# Altium project caravan_pcb.PrjPcb
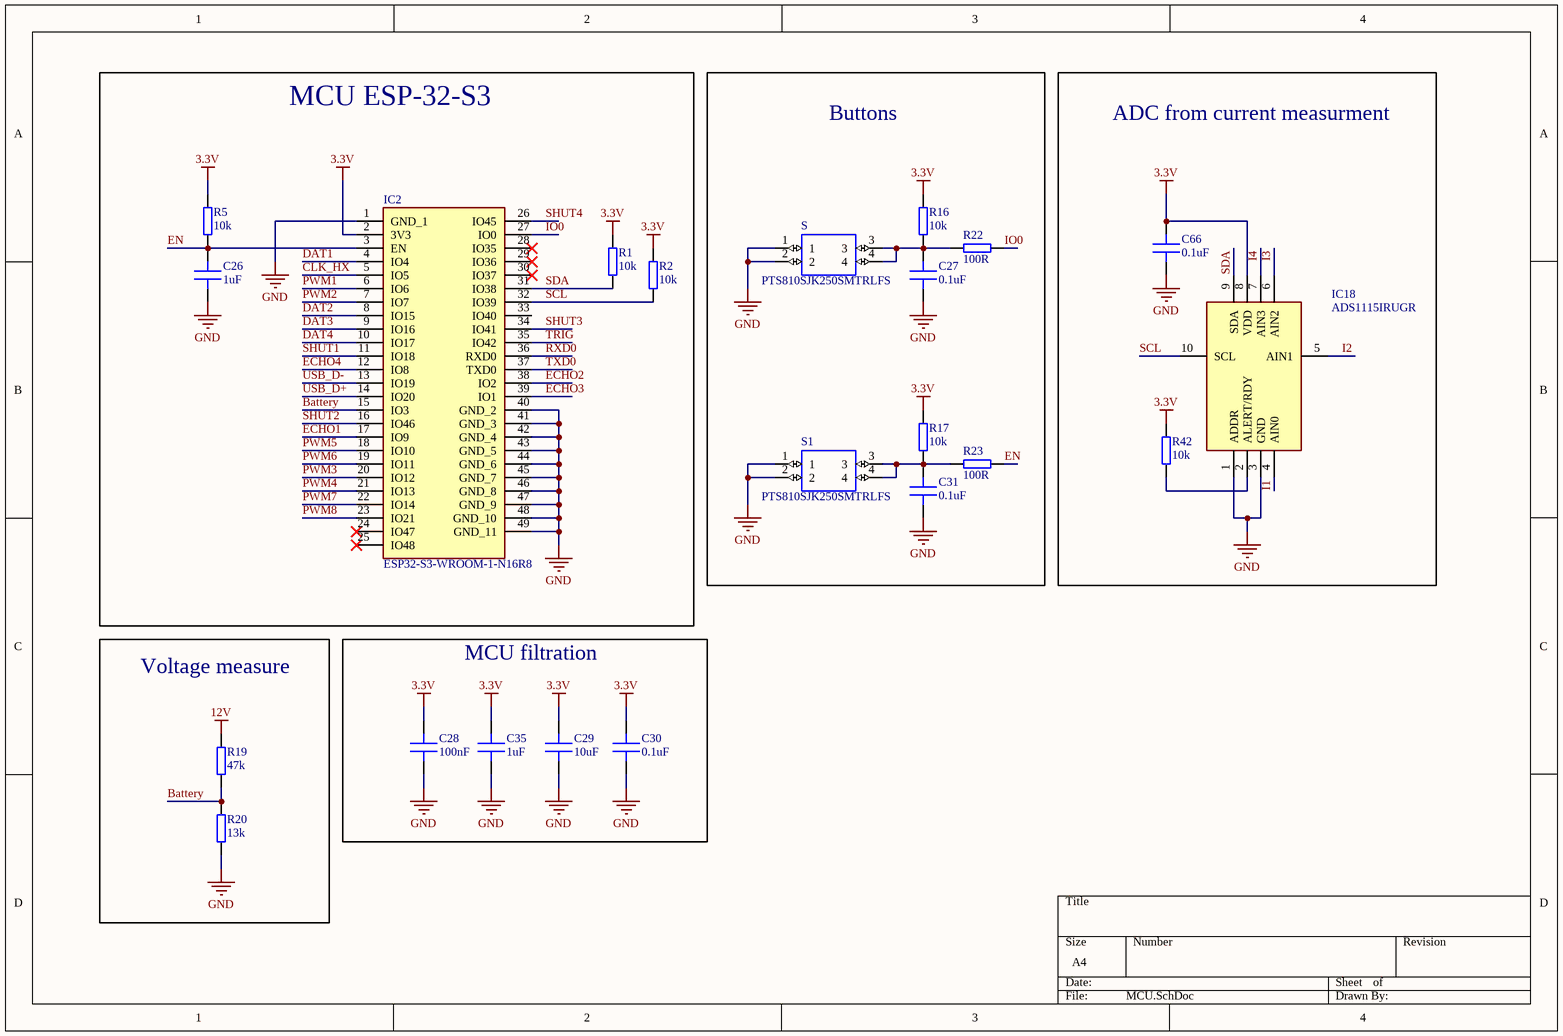
[diagram p0: MCU.SchDoc]
7 sheets, 168 parts. Net scope: global (net labels, ports and power ports of the same name join across sheets).
Board file: PCB1.PcbDoc
Sheets:
  MCU.SchDoc
  DC_DRIVERS.SchDoc
  DC-DC.SchDoc
  INTERFACE.SchDoc
  Amplifiers1.SchDoc
  Amplifiers2.SchDoc
  Sensors.SchDoc

## Sheet MCU.SchDoc
size A4; SheetNumber: 1; SheetTotal: 7

### Parts
C26  1uF  [C 0402]
C27  0.1uF  [C 0402]
C28  100nF  [C 0402]
C29  10uF  [C 0402]
C30  0.1uF  [C 0402]
C31  0.1uF  [C 0402]
C35  1uF  [C 0402]
C66  0.1uF  [C 0402]
IC2  ESP32-S3-WROOM-1-N16R8  [ESP32S3WROOM1N16R8]
IC18  ADS1115IRUGR  [ADS1115IRUGR]
R1  10k  [R 0402]
R2  10k  [R 0402]
R5  10k  [R 0402]
R16  10k  [R 0402]
R17  10k  [R 0402]
R19  47k  [R 0402]
R20  13k  [R 0402]
R22  100R  [R 0402]
R23  100R  [R 0402]
R42  10k  [R 0402]
S  PTS810SJK250SMTRLFS  [PTS810SJG250SMTRLFS]
S1  PTS810SJK250SMTRLFS  [PTS810SJG250SMTRLFS]

### Blocks framed on the sheet
MCU ESP-32-S3: C26 IC2 R1 R2 R5
Buttons: C27 C31 R16 R17 R22 R23 S S1
ADC from current measurment: C66 IC18 R42
Voltage measure: R19 R20
MCU filtration: C28-C30 C35

### Nets
3.3V: C28.1 C29.1 C30.1 C35.1 C66.1 IC2.2(3V3) IC18.8(VDD) R1.2 R2.2 R5.2 R16.2 R17.2 R42.2
12V: R19.2
GND: C26.2 C27.2 C28.2 C29.2 C30.2 C31.2 C35.2 C66.2 IC2.1(GND_1) IC2.40(GND_2) IC2.41(GND_3) IC2.42(GND_4) IC2.43(GND_5) IC2.44(GND_6) IC2.45(GND_7) IC2.46(GND_8) IC2.47(GND_9) IC2.48(GND_10) IC2.49(GND_11) IC18.1(ADDR) IC18.3(GND) R20.1 S.1 S.2 S1.1 S1.2
Battery: IC2.15(IO3) R19.1 R20.2
CLK_HX: IC2.5(IO5)
DAT1: IC2.4(IO4)
DAT2: IC2.8(IO15)
DAT3: IC2.9(IO16)
DAT4: IC2.10(IO17)
ECHO1: IC2.17(IO9)
ECHO2: IC2.38(IO2)
ECHO3: IC2.39(IO1)
ECHO4: IC2.12(IO8)
EN: C26.1 IC2.3(EN) R5.1 R23.1
I1: IC18.4(AIN0)
I2: IC18.5(AIN1)
I3: IC18.6(AIN2)
I4: IC18.7(AIN3)
IO0: IC2.27(IO0) R22.1
PWM1: IC2.6(IO6)
PWM2: IC2.7(IO7)
PWM3: IC2.20(IO12)
PWM4: IC2.21(IO13)
PWM5: IC2.18(IO10)
PWM6: IC2.19(IO11)
PWM7: IC2.22(IO14)
PWM8: IC2.23(IO21)
RXD0: IC2.36(RXD0)
SCL: IC2.32(IO39) IC18.10(SCL) R2.1
SDA: IC2.31(IO38) IC18.9(SDA) R1.1
SHUT1: IC2.11(IO18)
SHUT2: IC2.16(IO46)
SHUT3: IC2.34(IO41)
SHUT4: IC2.26(IO45)
TRIG: IC2.35(IO42)
TXD0: IC2.37(TXD0)
USB_D+: IC2.14(IO20)
USB_D-: IC2.13(IO19)
NetC27_1: C27.1 R16.1 R22.2 S.3 S.4
NetC31_1: C31.1 R17.1 R23.2 S1.3 S1.4
NetIC18_2: IC18.2(ALERT/RDY) R42.1

Not connected (* = marked no-connect by the designer): IC2 24(IO47)* 25(IO48)* 28(IO35)* 29(IO36)* 30(IO37)* 33(IO40)

### Library data of the parts
C26-C31 C35 C66 = Capacitor: MLCC Capacitor
IC2 = ESP32-S3-WROOM-1-N16R8: Integrated Circuit; Manufacturer_Name: Espressif Systems; Datasheet Link: https://www.espressif.com/sites/default/files/documentation/esp32-s3-wroom-1_wroom-1u_datasheet_en.pdf; Height: 3.25mm; Manufacturer_Part_Number: ESP32-S3-WROOM-1-N16R8; Mouser Part Number: 356-ESP32S3WRM1N16R8; Mouser Price/Stock: https://www.mouser.co.uk/ProductDetail/Espressif-Systems/ESP32-S3-WROOM-1-N16R8?qs=Li%252BoUPsLEnvQc9gW6AMhZg%3D%3D
IC18 = ADS1115IRUGR: Integrated Circuit; Manufacturer_Name: Texas Instruments; Datasheet Link: https://www.ti.com/lit/ds/symlink/ads1115.pdf?ts=1601235703022&ref_url=https%253A%252F%252Fwww.ti.com%252Fproduct%252FADS1115%253FkeyMatch%253DADS1115IRUGR%2526tisearch%253DSearch-EN-everything%2526usecase%253DOPN; Height: 0.4mm; Manufacturer_Part_Number: ADS1115IRUGR; Mouser Part Number: 595-ADS1115IRUGR; Mouser Price/Stock: https://www.mouser.co.uk/ProductDetail/Texas-Instruments/ADS1115IRUGR?qs=IK5e5L0zOXhqw%2F8AHSSbuA%3D%3D; Arrow Part Number: ADS1115IRUGR; Arrow Price/Stock: https://www.arrow.com/en/products/ads1115irugr/texas-instruments?region=nac
R1 R2 R5 R16 R17 R19 R20 R22 R23 R42 = Resistor: General pourpouse resistor
S S1 = PTS810SJK250SMTRLFS: Tactile Switch SPST-NO Top Actuated Surface Mount; MF: C&K; SnapEDA_Link: https://www.snapeda.com/parts/PTS810SJK250SMTRLFS/C%26K/view-part/274682/?ref=snap; Package: None; Price: None; MP: PTS810SJK250SMTRLFS; Availability: Unavailable; Value: *

## Sheet DC_DRIVERS.SchDoc
size A4; SheetNumber: 2; SheetTotal: 7
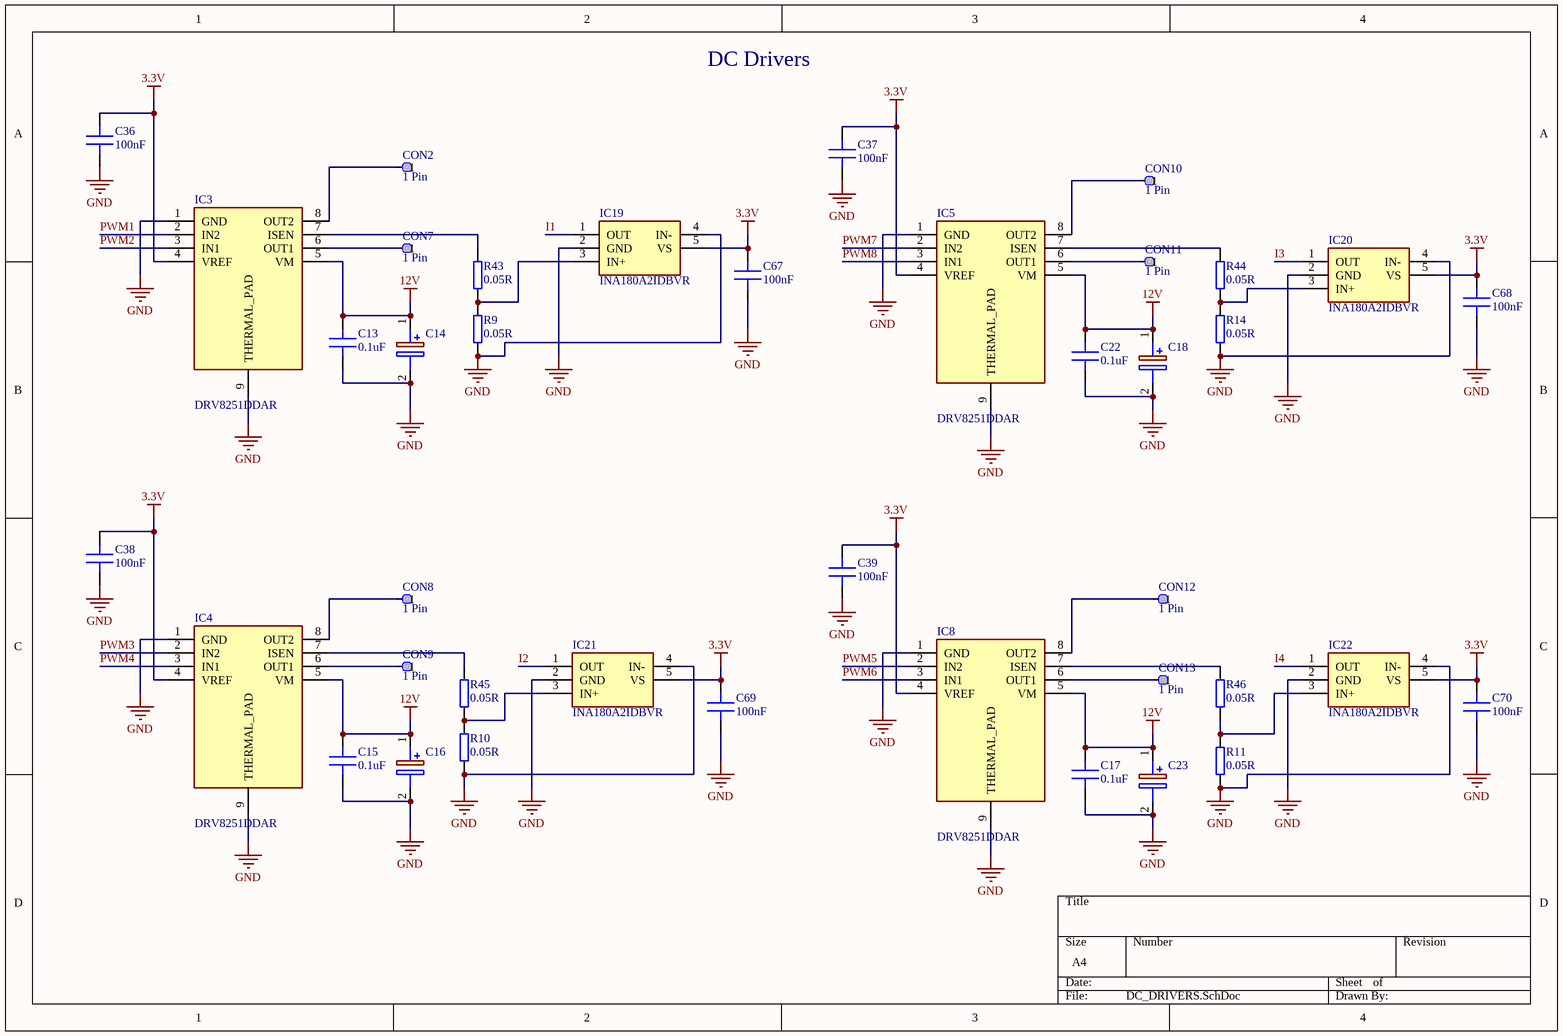
[diagram p1: DC_DRIVERS.SchDoc]

### Parts
C13  0.1uF  [C 0402]
C14  UVY1V101MED1TD  [CAPPRD250W50D655H1250]  (value not drawn)
C15  0.1uF  [C 0603]
C16  UVY1V101MED1TD  [CAPPRD250W50D655H1250]  (value not drawn)
C17  0.1uF  [C 0402]
C18  UVY1V101MED1TD  [CAPPRD250W50D655H1250]  (value not drawn)
C22  0.1uF  [C 0402]
C23  UVY1V101MED1TD  [CAPPRD250W50D655H1250]  (value not drawn)
C36  100nF  [C 0402]
C37  100nF  [C 0402]
C38  100nF  [C 0402]
C39  100nF  [C 0402]
C67  100nF  [C 0402]
C68  100nF  [C 0402]
C69  100nF  [C 0402]
C70  100nF  [C 0402]
CON2  1 Pin  [SMD PAD]
CON7  1 Pin  [SMD PAD]
CON8  1 Pin  [SMD PAD]
CON9  1 Pin  [SMD PAD]
CON10  1 Pin  [SMD PAD]
CON11  1 Pin  [SMD PAD]
CON12  1 Pin  [SMD PAD]
CON13  1 Pin  [SMD PAD]
IC3  DRV8251DDAR  [SOIC127P600X170-9N]
IC4  DRV8251DDAR  [SOIC127P600X170-9N]
IC5  DRV8251DDAR  [SOIC127P600X170-9N]
IC8  DRV8251DDAR  [SOIC127P600X170-9N]
IC19  INA180A2IDBVR  [SOT95P280X145-5N]
IC20  INA180A2IDBVR  [SOT95P280X145-5N]
IC21  INA180A2IDBVR  [SOT95P280X145-5N]
IC22  INA180A2IDBVR  [SOT95P280X145-5N]
R9  0.05R  [R 1206]
R10  0.05R  [R 1206]
R11  0.05R  [R 1206]
R14  0.05R  [R 1206]
R43  0.05R  [R 1206]
R44  0.05R  [R 1206]
R45  0.05R  [R 1206]
R46  0.05R  [R 1206]

### Nets
3.3V: C36.1 C37.1 C38.1 C39.1 C67.1 C68.1 C69.1 C70.1 IC3.4(VREF) IC4.4(VREF) IC5.4(VREF) IC8.4(VREF) IC19.5(VS) IC20.5(VS) IC21.5(VS) IC22.5(VS)
12V: C13.1 C14.1(+) C15.1 C16.1(+) C17.1 C18.1(+) C22.1 C23.1(+) IC3.5(VM) IC4.5(VM) IC5.5(VM) IC8.5(VM)
GND: C13.2 C14.2(-) C15.2 C16.2(-) C17.2 C18.2(-) C22.2 C23.2(-) C36.2 C37.2 C38.2 C39.2 C67.2 C68.2 C69.2 C70.2 IC3.1(GND) IC3.9(THERMAL_PAD) IC4.1(GND) IC4.9(THERMAL_PAD) IC5.1(GND) IC5.9(THERMAL_PAD) IC8.1(GND) IC8.9(THERMAL_PAD) IC19.2(GND) IC19.4(IN-) IC20.2(GND) IC20.4(IN-) IC21.2(GND) IC21.4(IN-) IC22.2(GND) IC22.4(IN-) R9.2 R10.2 R11.2 R14.2
I1: IC19.1(OUT)
I2: IC21.1(OUT)
I3: IC20.1(OUT)
I4: IC22.1(OUT)
PWM1: IC3.2(IN2)
PWM2: IC3.3(IN1)
PWM3: IC4.2(IN2)
PWM4: IC4.3(IN1)
PWM5: IC8.2(IN2)
PWM6: IC8.3(IN1)
PWM7: IC5.2(IN2)
PWM8: IC5.3(IN1)
NetCON2_1: CON2.1 IC3.8(OUT2)
NetCON7_1: CON7.1 IC3.6(OUT1)
NetCON8_1: CON8.1 IC4.8(OUT2)
NetCON9_1: CON9.1 IC4.6(OUT1)
NetCON10_1: CON10.1 IC5.8(OUT2)
NetCON11_1: CON11.1 IC5.6(OUT1)
NetCON12_1: CON12.1 IC8.8(OUT2)
NetCON13_1: CON13.1 IC8.6(OUT1)
NetIC3_7: IC3.7(ISEN) R43.1
NetIC4_7: IC4.7(ISEN) R45.1
NetIC5_7: IC5.7(ISEN) R44.1
NetIC8_7: IC8.7(ISEN) R46.1
NetIC19_3: IC19.3(IN+) R9.1 R43.2
NetIC20_3: IC20.3(IN+) R14.1 R44.2
NetIC21_3: IC21.3(IN+) R10.1 R45.2
NetIC22_3: IC22.3(IN+) R11.1 R46.2

### Notes on the sheet
- DC Drivers

### Library data of the parts
C13 C15 C17 C22 C36-C39 C67-C70 = Capacitor: MLCC Capacitor
C14 C16 C18 C23 = UVY1V101MED1TD: Capacitor Polarised; Manufacturer_Name: Nichicon; Datasheet Link: http://nichicon-us.com/english/products/pdfs/e-uvy.pdf; Height: 12.5mm; Manufacturer_Part_Number: UVY1V101MED1TD; Arrow Part Number: UVY1V101MED1TD; Arrow Price/Stock: https://www.arrow.com/en/products/uvy1v101med1td/nichicon
IC3-IC5 IC8 = DRV8251DDAR: Integrated Circuit; Manufacturer_Name: Texas Instruments; Datasheet Link: https://www.arrow.com/en/products/drv8251ddar/texas-instruments?region=nac; Height: 1.7mm; Manufacturer_Part_Number: DRV8251DDAR; Mouser Part Number: 595-DRV8251DDAR; Mouser Price/Stock: https://www.mouser.co.uk/ProductDetail/Texas-Instruments/DRV8251DDAR?qs=doiCPypUmgHTzZyfapGahQ%3D%3D; Arrow Part Number: DRV8251DDAR; Arrow Price/Stock: https://www.arrow.com/en/products/drv8251ddar/texas-instruments?region=nac
IC19-IC22 = INA180A2IDBVR: Integrated Circuit; Manufacturer_Name: Texas Instruments; Datasheet Link: http://www.ti.com/lit/ds/symlink/ina180.pdf; Height: 1.45mm; Manufacturer_Part_Number: INA180A2IDBVR; Mouser Part Number: 595-INA180A2IDBVR; Mouser Price/Stock: https://www.mouser.co.uk/ProductDetail/Texas-Instruments/INA180A2IDBVR?qs=5aG0NVq1C4wYcJfa99BoHg%3D%3D; Arrow Part Number: INA180A2IDBVR; Arrow Price/Stock: https://www.arrow.com/en/products/ina180a2idbvr/texas-instruments?utm_currency=USD&region=nac
R9-R11 R14 R43-R46 = Resistor: General pourpouse resistor

## Sheet DC-DC.SchDoc
size A4; SheetNumber: 3; SheetTotal: 7
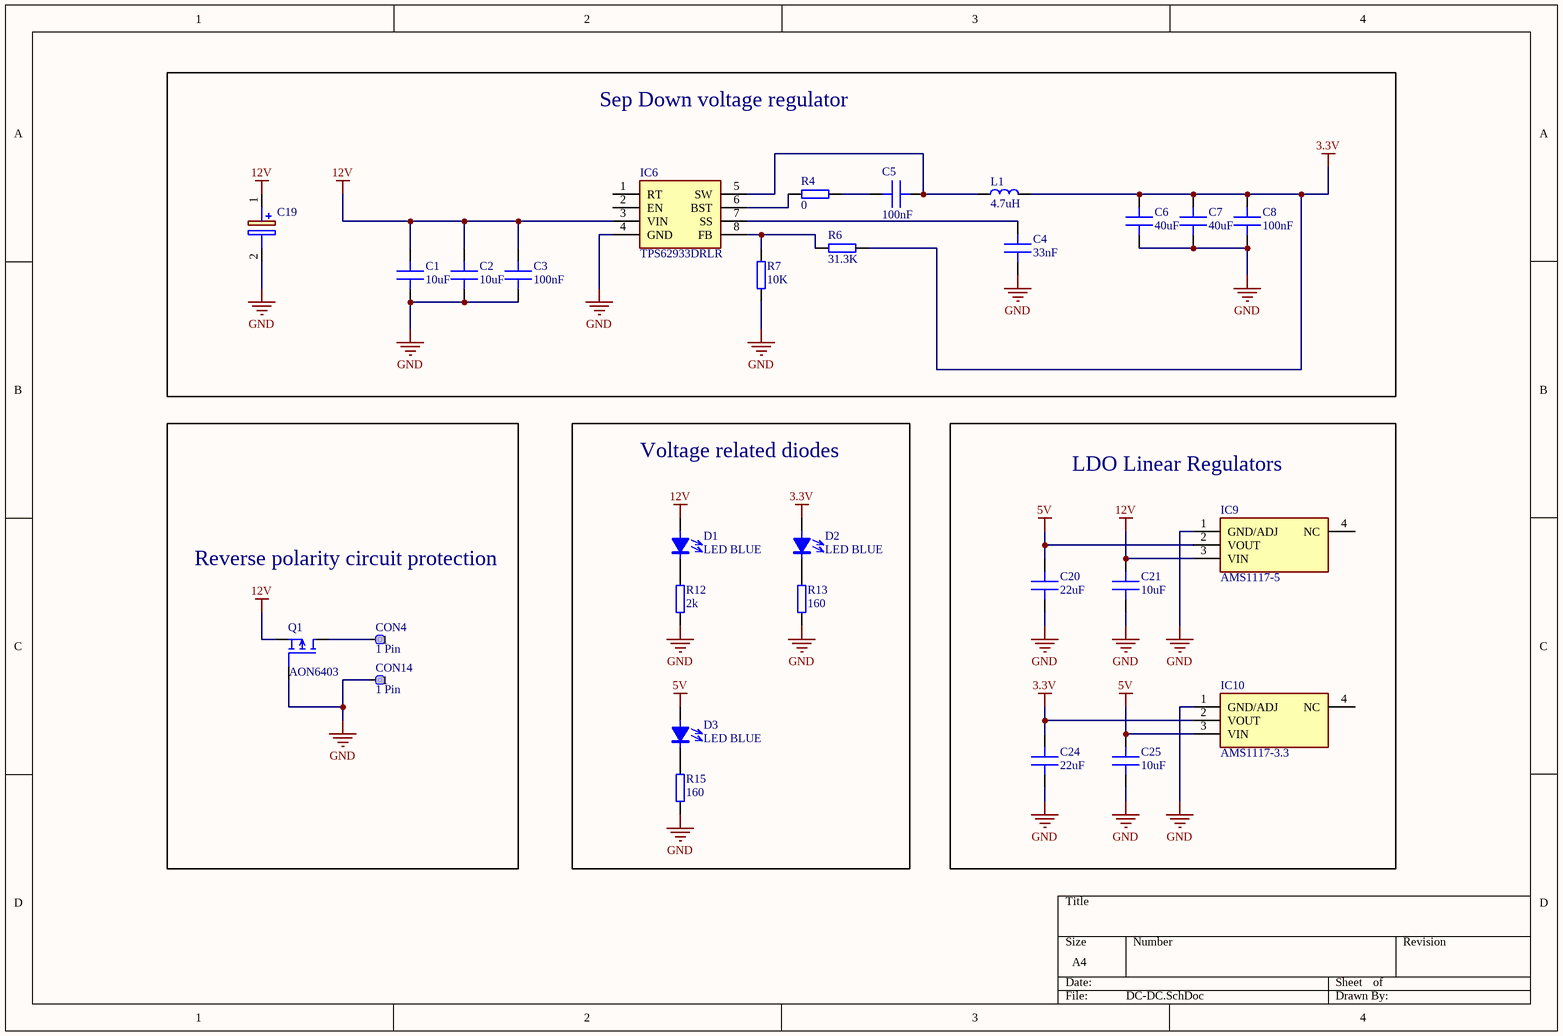
[diagram p2: DC-DC.SchDoc]

### Parts
C1  10uF  [C 1206]
C2  10uF  [C 1206]
C3  100nF  [C 0603]
C4  33nF  [C 0402]
C5  100nF  [C 0402]
C6  40uF  [C 1206]
C7  40uF  [C 1206]
C8  100nF  [C 0603]
C19  UVY1V101MED1TD  [CAPPRD250W50D655H1250]  (value not drawn)
C20  22uF  [C 0805]
C21  10uF  [C 0805]
C24  22uF  [C 0805]
C25  10uF  [C 0805]
CON4  1 Pin  [SMD PAD]
CON14  1 Pin  [SMD PAD]
D1  LED BLUE  [LED 0603 BLUE]
D2  LED BLUE  [LED 0603 BLUE]
D3  LED BLUE  [LED 0603 BLUE]
IC6  TPS62933DRLR  [SOTFL50P160X60-8N]
IC9  AMS1117-5  [SOT229P700X180-4N]
IC10  AMS1117-3.3  [SOT229P700X180-4N]
L1  4.7uH  [HPI0630]
Q1  AON6403  [DFN 5x6]
R4  0  [R 0402]
R6  31.3K  [R 0402]
R7  10K  [R 0402]
R12  2k  [R 0402]
R13  160  [R 0402]
R15  160  [R 0402]

### Blocks framed on the sheet
Sep Down voltage regulator: C1-C8 C19 IC6 L1 R4 R6 R7
Reverse polarity circuit protection: CON4 CON14 Q1
Voltage related diodes: D1-D3 R12 R13 R15
LDO Linear Regulators: C20 C21 C24 C25 IC9 IC10

### Nets
3.3V: C6.1 C7.1 C8.1 C24.1 D2.1 IC10.2(VOUT) L1.2 R6.1
5V: C20.1 C25.1 D3.1 IC9.2(VOUT) IC10.3(VIN)
12V: C1.1 C2.1 C3.1 C19.1(+) C21.1 D1.1 IC6.3(VIN) IC9.3(VIN) Q1.1,_2,_3(S)
GND: C1.2 C2.2 C3.2 C4.2 C6.2 C7.2 C8.2 C19.2(-) C20.2 C21.2 C24.2 C25.2 CON14.1 IC6.4(GND) IC9.1(GND/ADJ) IC10.1(GND/ADJ) Q1.4(G) R7.1 R12.1 R13.1 R15.1
NetC4_1: C4.1 IC6.7(SS)
NetC5_1: C5.1 R4.1
NetC5_2: C5.2 IC6.5(SW) L1.1
NetCON4_1: CON4.1 Q1.5_8(D)
NetD1_2: D1.2 R12.2
NetD2_2: D2.2 R13.2
NetD3_2: D3.2 R15.2
NetIC6_6: IC6.6(BST) R4.2
NetIC6_8: IC6.8(FB) R6.2 R7.2

Not connected (* = marked no-connect by the designer): IC6 1(RT) 2(EN); IC9 4(NC); IC10 4(NC)

### Library data of the parts
C1-C8 C20 C21 C24 C25 = Capacitor: MLCC Capacitor
C19 = UVY1V101MED1TD: as C14 on sheet DC_DRIVERS; Datasheet Link: http://nichicon-us.com/english/products/pdfs/e-uvy.pdf; Height: 12.5mm; Manufacturer_Part_Number: UVY1V101MED1TD; Arrow Part Number: UVY1V101MED1TD; Arrow Price/Stock: https://www.arrow.com/en/products/uvy1v101med1td/nichicon
IC6 = TPS62933DRLR: Integrated Circuit; Manufacturer_Name: Texas Instruments; Datasheet Link: https://www.ti.com/lit/ds/symlink/tps62933.pdf?ts=1626073394234; Height: 0.6mm; Manufacturer_Part_Number: TPS62933DRLR; Mouser Part Number: 595-TPS62933DRLR; Mouser Price/Stock: https://www.mouser.co.uk/ProductDetail/Texas-Instruments/TPS62933DRLR?qs=Rp5uXu7WBW9fv47wfQVntQ%3D%3D; Arrow Part Number: TPS62933DRLR; Arrow Price/Stock: https://www.arrow.com/en/products/tps62933drlr/texas-instruments?utm_currency=USD&region=nac
IC9 IC10 = AMS1117-3.3: Integrated Circuit; Manufacturer_Name: Advanced; Datasheet Link: https://datasheet.datasheetarchive.com/originals/distributors/Datasheets-28/DSA-550594.pdf; Height: 1.8mm; Manufacturer_Part_Number: AMS1117-3.3
L1 = Inductor: General pourpouse inductor
Q1 = AON6403: P-Mosfet 30V 67A Rds(on) 3.1mR
R4 R6 R7 R12 R13 R15 = Resistor: General pourpouse resistor

## Sheet INTERFACE.SchDoc
size A4; SheetNumber: 4; SheetTotal: 4

## Sheet Amplifiers1.SchDoc
size A4; SheetNumber: 5; SheetTotal: 7
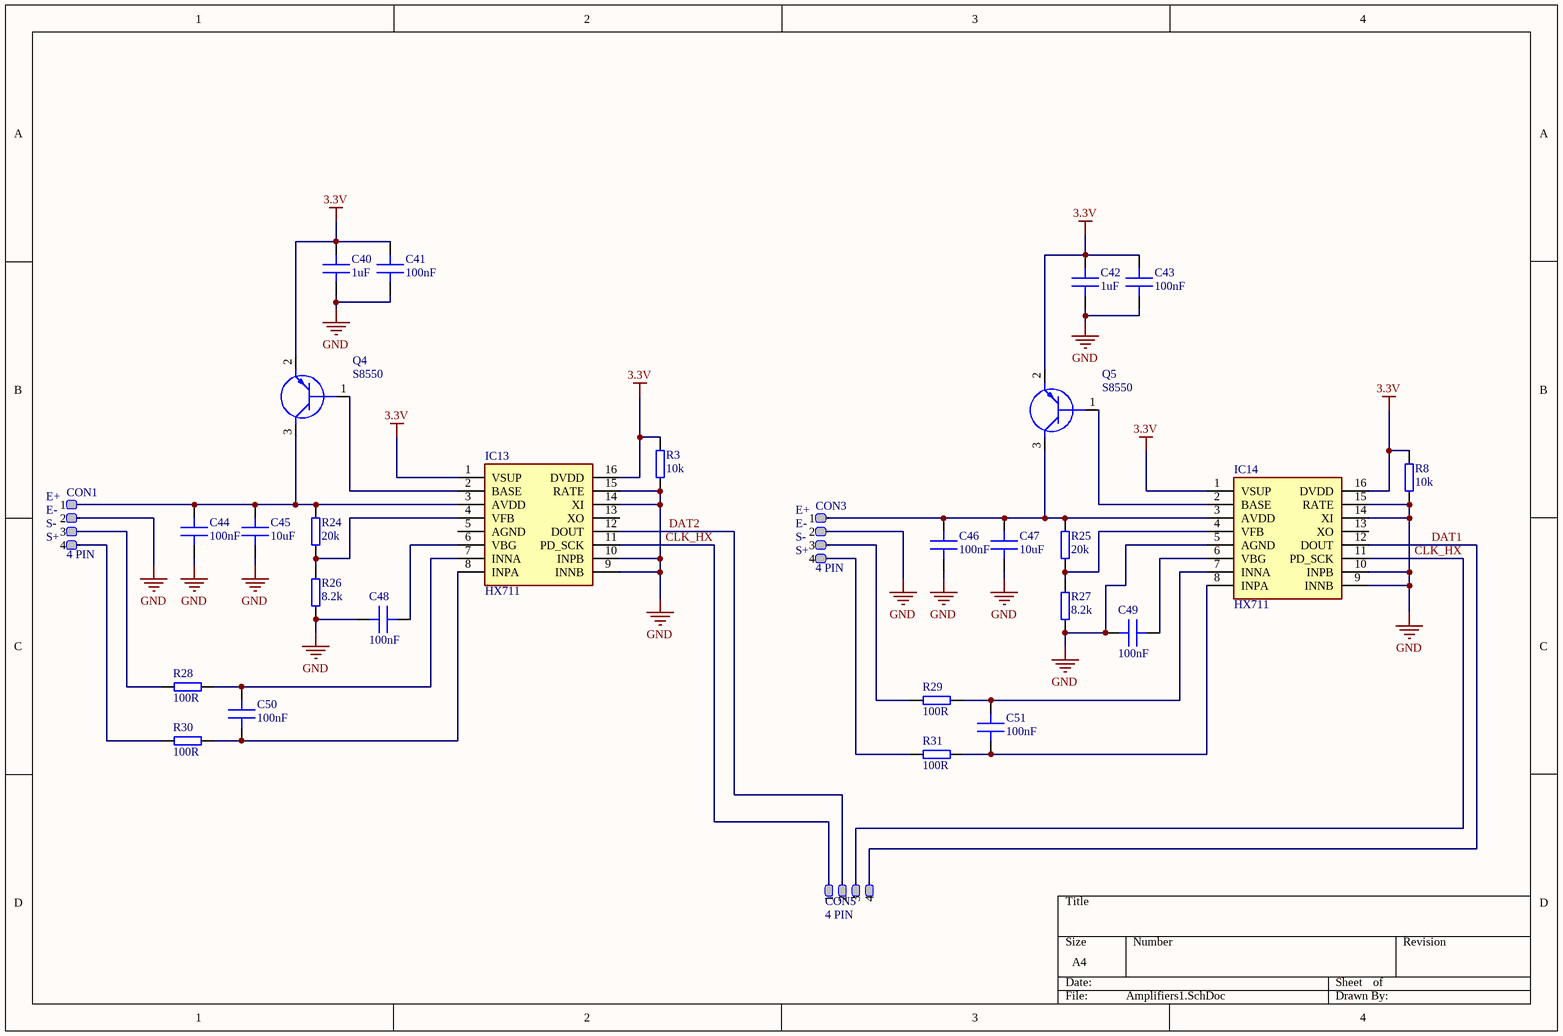
[diagram p3: Amplifiers1.SchDoc]

### Parts
C40  1uF  [C 0402]
C41  100nF  [C 0402]
C42  1uF  [C 0402]
C43  100nF  [C 0402]
C44  100nF  [C 0402]
C45  10uF  [C 0402]
C46  100nF  [C 0402]
C47  10uF  [C 0402]
C48  100nF  [C 0402]
C49  100nF  [C 0402]
C50  100nF  [C 0402]
C51  100nF  [C 0402]
CON1  4 PIN  [BM04B-SRSS-TB]
CON3  4 PIN  [BM04B-SRSS-TB]
CON5  4 PIN  [Goldpin 1.27mm 4PIN]
IC13  HX711  [SOIC127P600X160-16N]
IC14  HX711  [SOIC127P600X160-16N]
Q4  S8550  [SOT95P240X110-3N]
Q5  S8550  [SOT95P240X110-3N]
R3  10k  [R 0402]
R8  10k  [R 0402]
R24  20k  [R 0402]
R25  20k  [R 0402]
R26  8.2k  [R 0402]
R27  8.2k  [R 0402]
R28  100R  [R 0402]
R29  100R  [R 0402]
R30  100R  [R 0402]
R31  100R  [R 0402]

### Nets
3.3V: C40.1 C41.1 C42.1 C43.1 IC13.1(VSUP) IC13.16(DVDD) IC14.1(VSUP) IC14.16(DVDD) Q4.2(E) Q5.2(E) R3.2 R8.2
GND: C40.2 C41.2 C42.2 C43.2 C44.2 C45.2 C46.2 C47.2 C48.1 C49.1 CON1.2 CON3.2 IC13.9(INNB) IC13.10(INPB) IC13.14(XI) IC13.15(RATE) IC14.5(AGND) IC14.9(INNB) IC14.10(INPB) IC14.14(XI) IC14.15(RATE) R3.1 R8.1 R26.1 R27.1
CLK_HX: CON5.1 CON5.3 IC13.11(PD_SCK) IC14.11(PD_SCK)
DAT1: CON5.4 IC14.12(DOUT)
DAT2: CON5.2 IC13.12(DOUT)
NetC44_1: C44.1 C45.1 CON1.1 IC13.3(AVDD) Q4.3(C) R24.2
NetC46_1: C46.1 C47.1 CON3.1 IC14.3(AVDD) Q5.3(C) R25.2
NetC48_2: C48.2 IC13.6(VBG)
NetC49_2: C49.2 IC14.6(VBG)
NetC50_1: C50.1 IC13.8(INPA) R30.1
NetC50_2: C50.2 IC13.7(INNA) R28.1
NetC51_1: C51.1 IC14.8(INPA) R31.1
NetC51_2: C51.2 IC14.7(INNA) R29.1
NetCON1_3: CON1.3 R28.2
NetCON1_4: CON1.4 R30.2
NetCON3_3: CON3.3 R29.2
NetCON3_4: CON3.4 R31.2
NetIC13_2: IC13.2(BASE) Q4.1(B)
NetIC13_4: IC13.4(VFB) R24.1 R26.2
NetIC14_2: IC14.2(BASE) Q5.1(B)
NetIC14_4: IC14.4(VFB) R25.1 R27.2

Not connected (* = marked no-connect by the designer): IC13 5(AGND) 13(XO); IC14 13(XO)

### Notes on the sheet
- (near CON1) E+
- (near CON1) E-
- (near CON3) E+
- (near CON1) S-
- (near CON1) S+
- (near CON3) E-
- (near CON3) S-
- (near CON3) S+

### Library data of the parts
C40-C51 = Capacitor: MLCC Capacitor
IC13 IC14 = HX711: Integrated Circuit; Manufacturer_Name: AVIA; Datasheet Link: https://cdn.sparkfun.com/datasheets/Sensors/ForceFlex/hx711_english.pdf; Height: 1.6mm; Manufacturer_Part_Number: HX711
Q4 Q5 = S8550: Transistor BJT PNP; Manufacturer_Name: Galaxy; Datasheet Link: https://datasheet.datasheetarchive.com/originals/distributors/Datasheets-3/DSA-49109.pdf; Height: 1.1mm; Manufacturer_Part_Number: S8550
R3 R8 R24-R31 = Resistor: General pourpouse resistor

## Sheet Amplifiers2.SchDoc
size A4; SheetNumber: 6; SheetTotal: 7
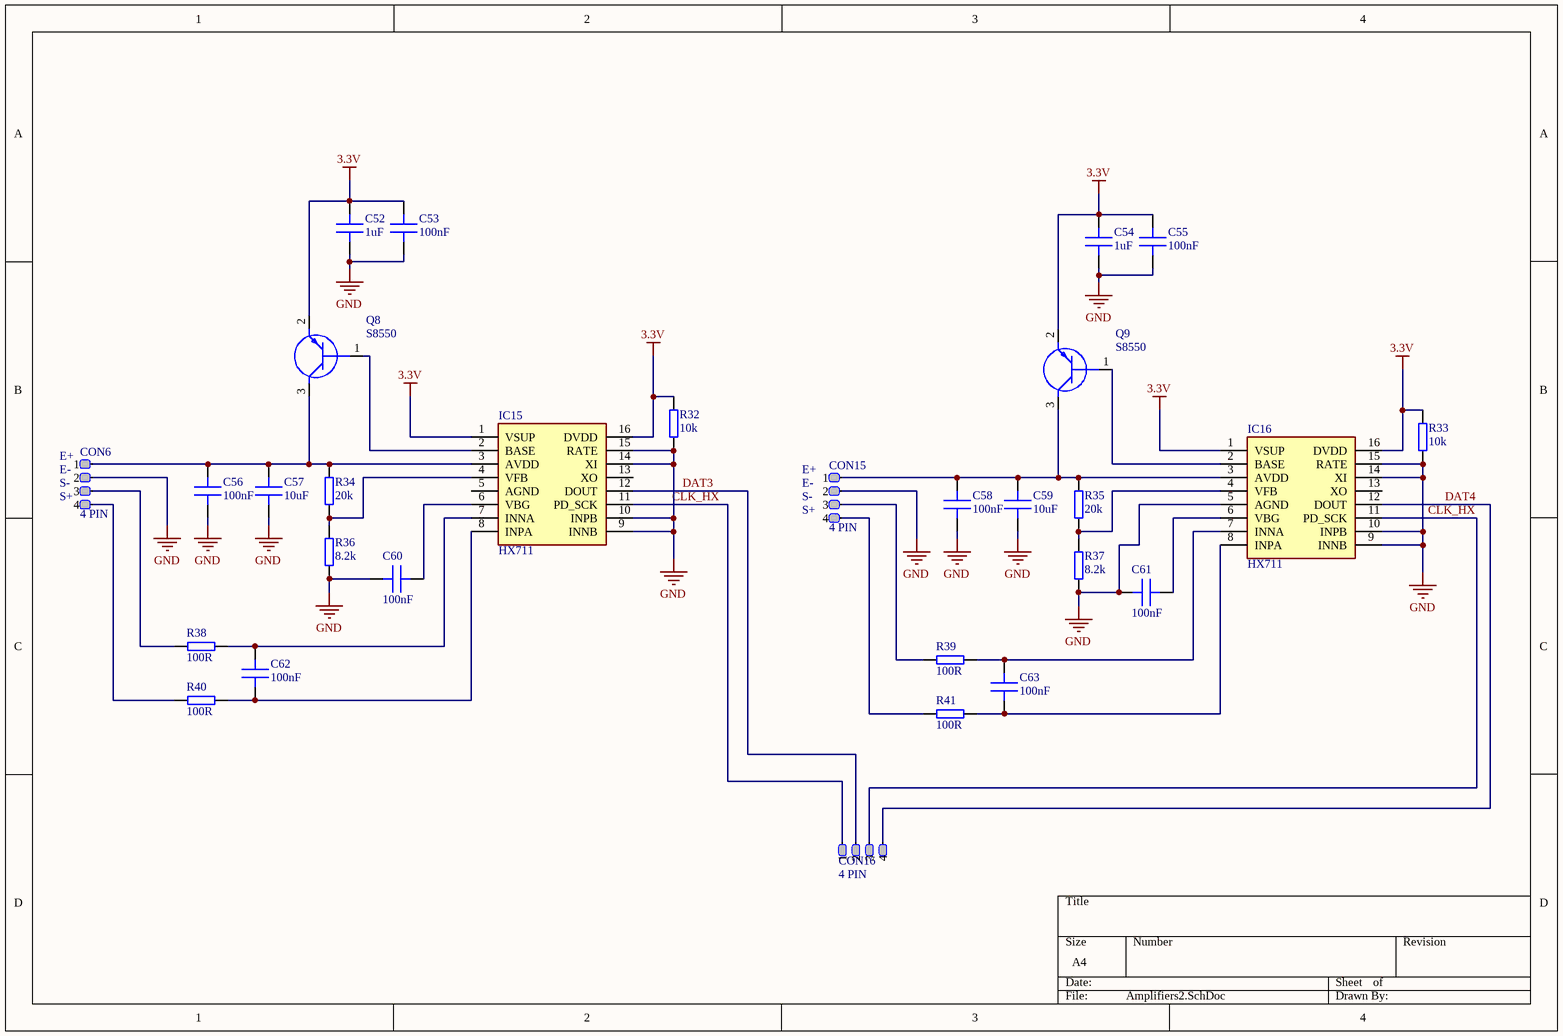
[diagram p4: Amplifiers2.SchDoc]

### Parts
C52  1uF  [C 0402]
C53  100nF  [C 0402]
C54  1uF  [C 0402]
C55  100nF  [C 0402]
C56  100nF  [C 0402]
C57  10uF  [C 0402]
C58  100nF  [C 0402]
C59  10uF  [C 0402]
C60  100nF  [C 0402]
C61  100nF  [C 0402]
C62  100nF  [C 0402]
C63  100nF  [C 0402]
CON6  4 PIN  [BM04B-SRSS-TB]
CON15  4 PIN  [BM04B-SRSS-TB]
CON16  4 PIN  [Goldpin 1.27mm 4PIN]
IC15  HX711  [SOIC127P600X160-16N]
IC16  HX711  [SOIC127P600X160-16N]
Q8  S8550  [SOT95P240X110-3N]
Q9  S8550  [SOT95P240X110-3N]
R32  10k  [R 0402]
R33  10k  [R 0402]
R34  20k  [R 0402]
R35  20k  [R 0402]
R36  8.2k  [R 0402]
R37  8.2k  [R 0402]
R38  100R  [R 0402]
R39  100R  [R 0402]
R40  100R  [R 0402]
R41  100R  [R 0402]

### Nets
3.3V: C52.1 C53.1 C54.1 C55.1 IC15.1(VSUP) IC15.16(DVDD) IC16.1(VSUP) IC16.16(DVDD) Q8.2(E) Q9.2(E) R32.2 R33.2
GND: C52.2 C53.2 C54.2 C55.2 C56.2 C57.2 C58.2 C59.2 C60.1 C61.1 CON6.2 CON15.2 IC15.9(INNB) IC15.10(INPB) IC15.14(XI) IC15.15(RATE) IC16.5(AGND) IC16.9(INNB) IC16.10(INPB) IC16.14(XI) IC16.15(RATE) R32.1 R33.1 R36.1 R37.1
CLK_HX: CON16.1 CON16.3 IC15.11(PD_SCK) IC16.11(PD_SCK)
DAT3: CON16.2 IC15.12(DOUT)
DAT4: CON16.4 IC16.12(DOUT)
NetC56_1: C56.1 C57.1 CON6.1 IC15.3(AVDD) Q8.3(C) R34.2
NetC58_1: C58.1 C59.1 CON15.1 IC16.3(AVDD) Q9.3(C) R35.2
NetC60_2: C60.2 IC15.6(VBG)
NetC61_2: C61.2 IC16.6(VBG)
NetC62_1: C62.1 IC15.8(INPA) R40.1
NetC62_2: C62.2 IC15.7(INNA) R38.1
NetC63_1: C63.1 IC16.8(INPA) R41.1
NetC63_2: C63.2 IC16.7(INNA) R39.1
NetCON6_3: CON6.3 R38.2
NetCON6_4: CON6.4 R40.2
NetCON15_3: CON15.3 R39.2
NetCON15_4: CON15.4 R41.2
NetIC15_2: IC15.2(BASE) Q8.1(B)
NetIC15_4: IC15.4(VFB) R34.1 R36.2
NetIC16_2: IC16.2(BASE) Q9.1(B)
NetIC16_4: IC16.4(VFB) R35.1 R37.2

Not connected (* = marked no-connect by the designer): IC15 5(AGND) 13(XO); IC16 13(XO)

### Notes on the sheet
- (near CON6) E+
- (near CON6) E-
- (near CON6) S-
- (near CON6) S+
- (near CON15) E+
- (near CON15) E-
- (near CON15) S-
- (near CON15) S+

### Library data of the parts
C52-C63 = Capacitor: MLCC Capacitor
IC15 IC16 = HX711: as IC13 on sheet Amplifiers1; Datasheet Link: https://cdn.sparkfun.com/datasheets/Sensors/ForceFlex/hx711_english.pdf; Height: 1.6mm; Manufacturer_Part_Number: HX711
Q8 Q9 = S8550: as Q4 on sheet Amplifiers1; Datasheet Link: https://datasheet.datasheetarchive.com/originals/distributors/Datasheets-3/DSA-49109.pdf; Height: 1.1mm; Manufacturer_Part_Number: S8550
R32-R41 = Resistor: General pourpouse resistor

## Sheet Sensors.SchDoc
size A4; SheetNumber: 7; SheetTotal: 7
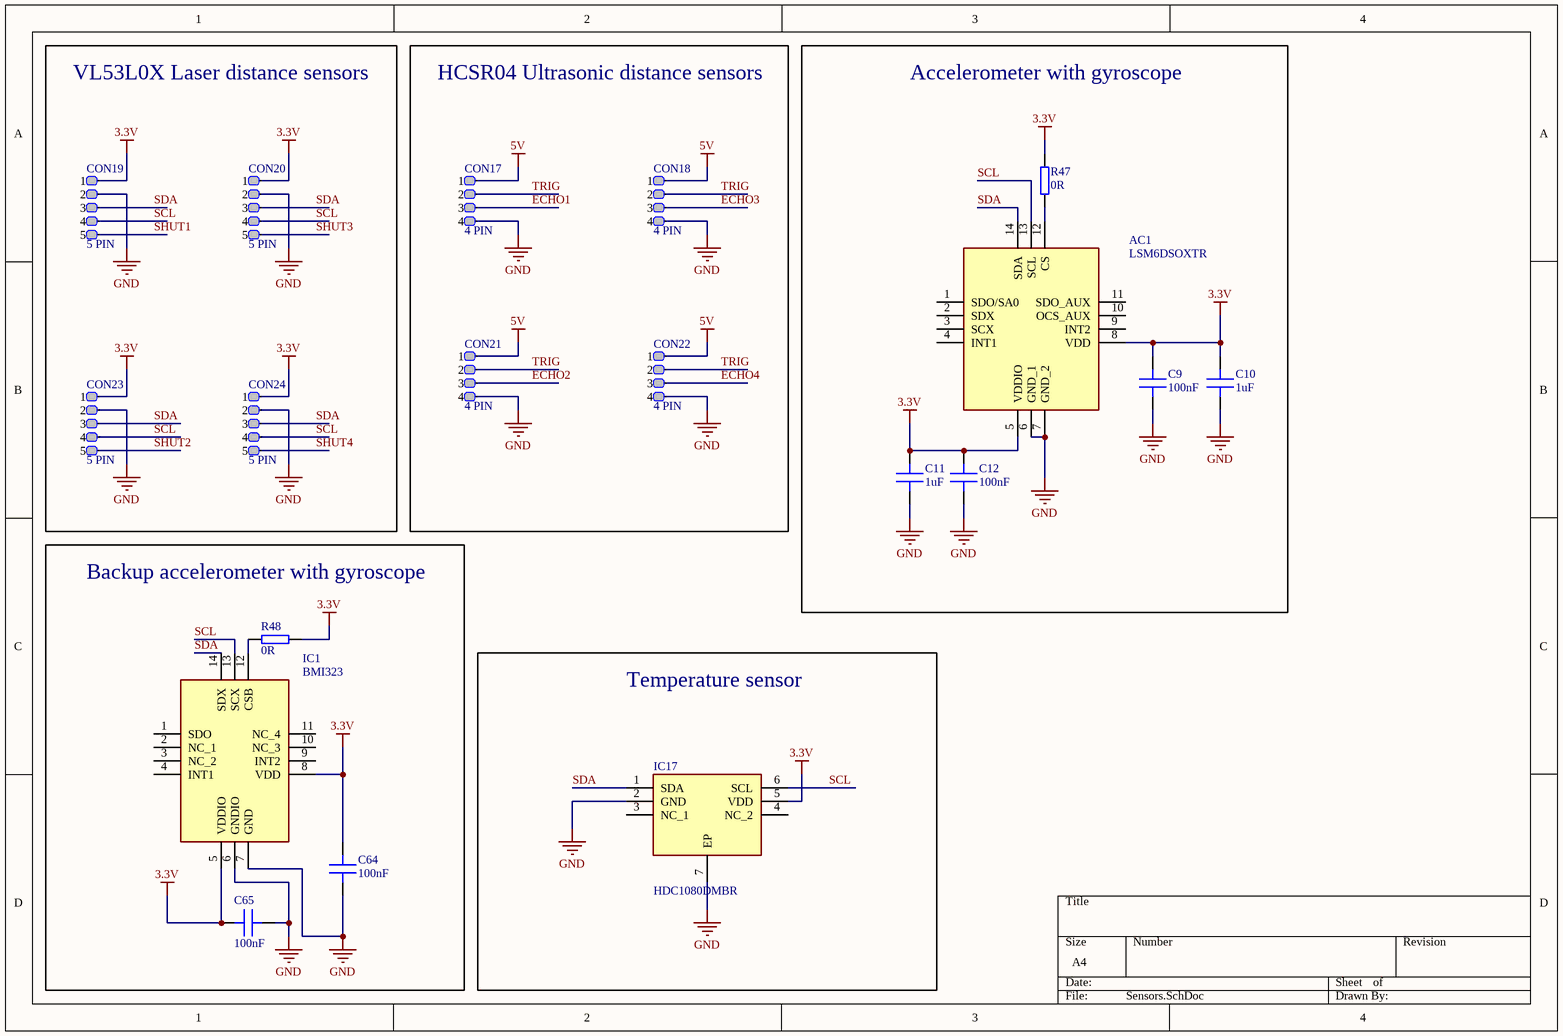
[diagram p5: Sensors.SchDoc]

### Parts
AC1  LSM6DSOXTR  [LGA-14_1]
C9  100nF  [C 0402]
C10  1uF  [C 0402]
C11  1uF  [C 0402]
C12  100nF  [C 0402]
C64  100nF  [C 0402]
C65  100nF  [C 0402]
CON17  4 PIN  [Goldpin 2.54 4P]
CON18  4 PIN  [Goldpin 2.54 4P]
CON19  5 PIN  [Goldpin 2.54mm  5Pin]
CON20  5 PIN  [Goldpin 2.54mm  5Pin]
CON21  4 PIN  [Goldpin 2.54 4P]
CON22  4 PIN  [Goldpin 2.54 4P]
CON23  5 PIN  [Goldpin 2.54mm  5Pin]
CON24  5 PIN  [Goldpin 2.54mm  5Pin]
IC1  BMI323  [BMI323]
IC17  HDC1080DMBR  [SON100P300X300X80-7N-D]
R47  0R  [R 0402]
R48  0R  [R 0402]

### Blocks framed on the sheet
VL53L0X Laser distance sensors: CON19 CON20 CON23 CON24
HCSR04 Ultrasonic distance sensors: CON17 CON18 CON21 CON22
Accelerometer with gyroscope: AC1 C9-C12 R47
Backup accelerometer with gyroscope: C64 C65 IC1 R48
Temperature sensor: IC17

### Nets
3.3V: AC1.5(VDDIO) AC1.8(VDD) C9.1 C10.1 C11.1 C12.1 C64.2 C65.1 CON19.1 CON20.1 CON23.1 CON24.1 IC1.5(VDDIO) IC1.8(VDD) IC17.5(VDD) R47.2 R48.2
5V: CON17.1 CON18.1 CON21.1 CON22.1
GND: AC1.6(GND_1) AC1.7(GND_2) C9.2 C10.2 C11.2 C12.2 C64.1 C65.2 CON17.4 CON18.4 CON19.2 CON20.2 CON21.4 CON22.4 CON23.2 CON24.2 IC1.6(GNDIO) IC1.7(GND) IC17.2(GND) IC17.7(EP)
ECHO1: CON17.3
ECHO2: CON21.3
ECHO3: CON18.3
ECHO4: CON22.3
SCL: AC1.13(SCL) CON19.4 CON20.4 CON23.4 CON24.4 IC1.13(SCX) IC17.6(SCL)
SDA: AC1.14(SDA) CON19.3 CON20.3 CON23.3 CON24.3 IC1.14(SDX) IC17.1(SDA)
SHUT1: CON19.5
SHUT2: CON23.5
SHUT3: CON20.5
SHUT4: CON24.5
TRIG: CON17.2 CON18.2 CON21.2 CON22.2
NetAC1_12: AC1.12(CS) R47.1
NetIC1_12: IC1.12(CSB) R48.1

Not connected (* = marked no-connect by the designer): AC1 1(SDO/SA0) 2(SDX) 3(SCX) 4(INT1) 9(INT2) 10(OCS_AUX) 11(SDO_AUX); IC1 1(SDO) 2(NC_1) 3(NC_2) 4(INT1) 9(INT2) 10(NC_3) 11(NC_4); IC17 3(NC_1) 4(NC_2)

### Library data of the parts
AC1 = LSM6DSOXTR: Accelerometer; Manufacturer_Name: STMicroelectronics; Datasheet Link: https://www.st.com/resource/en/datasheet/lsm6dsox.pdf; Manufacturer_Part_Number: LSM6DSOXTR; Mouser Part Number: 511-LSM6DSOXTR; Mouser Price/Stock: https://www.mouser.co.uk/ProductDetail/STMicroelectronics/LSM6DSOXTR?qs=l7cgNqFNU1i9dcjzItLpVQ%3D%3D; Arrow Part Number: LSM6DSOXTR; Arrow Price/Stock: https://www.arrow.com/en/products/lsm6dsoxtr/stmicroelectronics?region=europe
C9-C12 C64 C65 = Capacitor: MLCC Capacitor
IC1 = BMI323: Integrated Circuit; Manufacturer_Name: BOSCH; Datasheet Link: https://www.bosch-sensortec.com/media/boschsensortec/downloads/datasheets/bst-bmi323-ds000.pdf; Height: 0.87mm; Manufacturer_Part_Number: BMI323; Mouser Part Number: 262-BMI323; Mouser Price/Stock: https://www.mouser.co.uk/ProductDetail/Bosch-Sensortec/BMI323?qs=By6Nw2ByBD3%2FE1v0UqNQPQ%3D%3D; Arrow Part Number: BMI323; Arrow Price/Stock: https://www.arrow.com/en/products/bmi323/bosch?utm_currency=USD&region=nac
IC17 = HDC1080DMBR: Integrated Circuit; Manufacturer_Name: Texas Instruments; Datasheet Link: http://www.ti.com/lit/gpn/HDC1080; Height: 0.8mm; Manufacturer_Part_Number: HDC1080DMBR; Mouser Part Number: 595-HDC1080DMBR; Mouser Price/Stock: https://www.mouser.co.uk/ProductDetail/Texas-Instruments/HDC1080DMBR?qs=8%2FmU9qzJpL9OuhPLRSO9Vg%3D%3D; Arrow Part Number: HDC1080DMBR; Arrow Price/Stock: https://www.arrow.com/en/products/hdc1080dmbr/texas-instruments?region=nac
R47 R48 = Resistor: General pourpouse resistor

## Nets that join several sheets
3.3V: MCU (13 pins), DC_DRIVERS (16 pins), DC-DC (8 pins), Amplifiers1 (12 pins), Amplifiers2 (12 pins), Sensors (17 pins)
5V: DC-DC (5 pins), Sensors (CON17.1 CON18.1 CON21.1 CON22.1)
12V: MCU (R19.2), DC_DRIVERS (12 pins), DC-DC (9 pins)
GND: MCU (26 pins), DC_DRIVERS (36 pins), DC-DC (21 pins), Amplifiers1 (25 pins), Amplifiers2 (25 pins), Sensors (20 pins)
CLK_HX: MCU (IC2.5), Amplifiers1 (CON5.1 CON5.3 IC13.11 IC14.11), Amplifiers2 (CON16.1 CON16.3 IC15.11 IC16.11)
DAT1: MCU (IC2.4), Amplifiers1 (CON5.4 IC14.12)
DAT2: MCU (IC2.8), Amplifiers1 (CON5.2 IC13.12)
DAT3: MCU (IC2.9), Amplifiers2 (CON16.2 IC15.12)
DAT4: MCU (IC2.10), Amplifiers2 (CON16.4 IC16.12)
ECHO1: MCU (IC2.17), Sensors (CON17.3)
ECHO2: MCU (IC2.38), Sensors (CON21.3)
ECHO3: MCU (IC2.39), Sensors (CON18.3)
ECHO4: MCU (IC2.12), Sensors (CON22.3)
I1: MCU (IC18.4), DC_DRIVERS (IC19.1)
I2: MCU (IC18.5), DC_DRIVERS (IC21.1)
I3: MCU (IC18.6), DC_DRIVERS (IC20.1)
I4: MCU (IC18.7), DC_DRIVERS (IC22.1)
PWM1: MCU (IC2.6), DC_DRIVERS (IC3.2)
PWM2: MCU (IC2.7), DC_DRIVERS (IC3.3)
PWM3: MCU (IC2.20), DC_DRIVERS (IC4.2)
PWM4: MCU (IC2.21), DC_DRIVERS (IC4.3)
PWM5: MCU (IC2.18), DC_DRIVERS (IC8.2)
PWM6: MCU (IC2.19), DC_DRIVERS (IC8.3)
PWM7: MCU (IC2.22), DC_DRIVERS (IC5.2)
PWM8: MCU (IC2.23), DC_DRIVERS (IC5.3)
SCL: MCU (IC2.32 IC18.10 R2.1), Sensors (7 pins)
SDA: MCU (IC2.31 IC18.9 R1.1), Sensors (7 pins)
SHUT1: MCU (IC2.11), Sensors (CON19.5)
SHUT2: MCU (IC2.16), Sensors (CON23.5)
SHUT3: MCU (IC2.34), Sensors (CON20.5)
SHUT4: MCU (IC2.26), Sensors (CON24.5)
TRIG: MCU (IC2.35), Sensors (CON17.2 CON18.2 CON21.2 CON22.2)